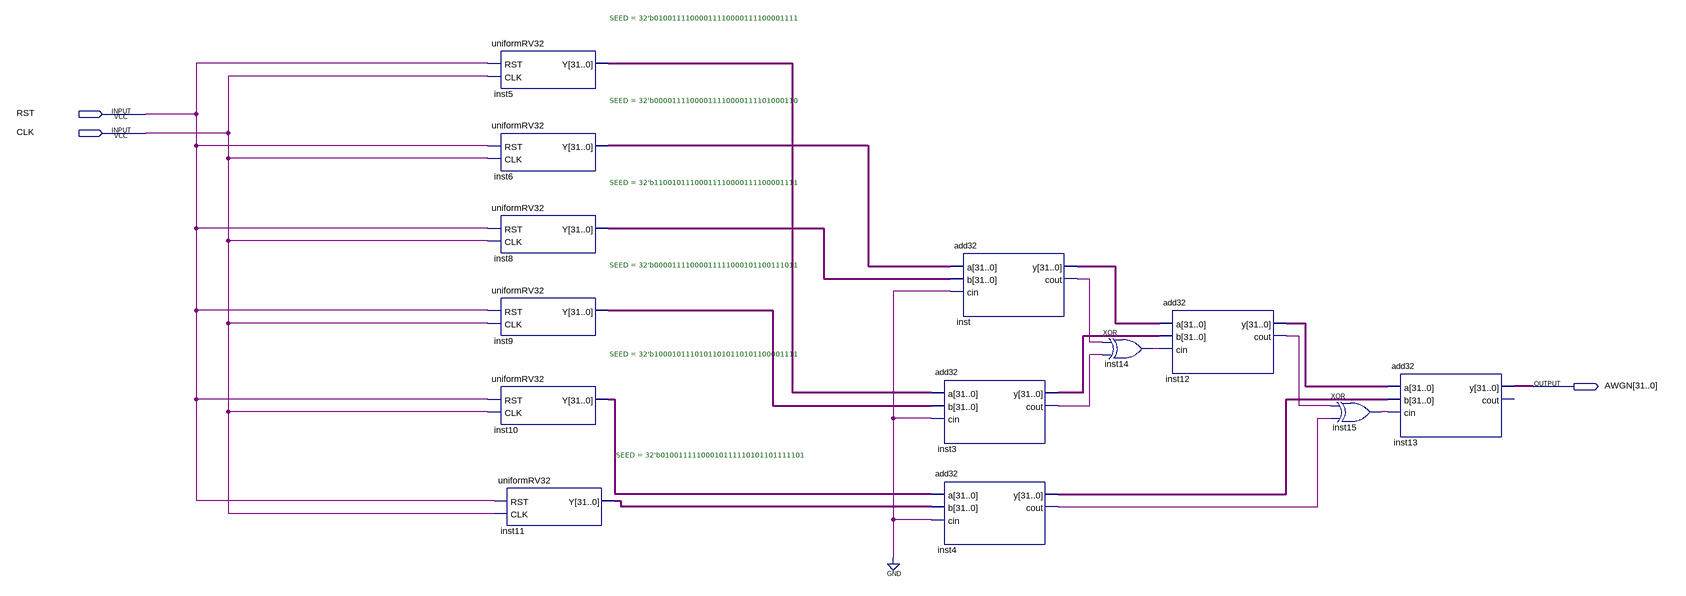
[diagram p0: schematic sheet]
// Quartus schematic noise_generator.bdf as structural Verilog: 13 symbols, 3 pins
module noise_generator (
  input  RST,
  input  CLK,
  output [31:0] AWGN
);

  wire inst3_cout, inst4_cout, inst12_cout, inst14_out, inst15_out, inst_cout;
  wire [31:0] inst3_y, inst4_y, inst5_y, inst6_y, inst8_y, inst9_y, inst10_y, inst11_y, inst12_y, inst_y;

  uniformRV32 #(.SEED(32'b01001111000011110000111100001111)) inst5 (.RST(RST), .CLK(CLK), .Y(inst5_y));
  uniformRV32 #(.SEED(32'b00001111000011110000111101000110)) inst6 (.RST(RST), .CLK(CLK), .Y(inst6_y));
  uniformRV32 #(.SEED(32'b11001011100011110000111100001111)) inst8 (.RST(RST), .CLK(CLK), .Y(inst8_y));
  uniformRV32 #(.SEED(32'b00001111000011111000101100111011)) inst9 (.RST(RST), .CLK(CLK), .Y(inst9_y));
  uniformRV32 #(.SEED(32'b10001011101011010110101100001111)) inst10 (.RST(RST), .CLK(CLK), .Y(inst10_y));
  uniformRV32 #(.SEED(32'b01001111100010111110101101111101)) inst11 (.RST(RST), .CLK(CLK), .Y(inst11_y));
  add32 inst (.a(inst6_y), .b(inst8_y), .cin(1'b0), .y(inst_y), .cout(inst_cout));
  add32 inst3 (.a(inst5_y), .b(inst9_y), .cin(1'b0), .y(inst3_y), .cout(inst3_cout));
  add32 inst4 (.a(inst10_y), .b(inst11_y), .cin(1'b0), .y(inst4_y), .cout(inst4_cout));
  xor inst14 (inst14_out, inst_cout, inst3_cout);
  add32 inst12 (.a(inst_y), .b(inst3_y), .cin(inst14_out), .y(inst12_y), .cout(inst12_cout));
  xor inst15 (inst15_out, inst12_cout, inst4_cout);
  add32 inst13 (.a(inst12_y), .b(inst4_y), .cin(inst15_out), .y(AWGN));  // open: cout
endmodule
